# Altium schematic sheet DIGITAL_INP.SchDoc
size A4; SheetNumber: 10; SheetTotal: 14
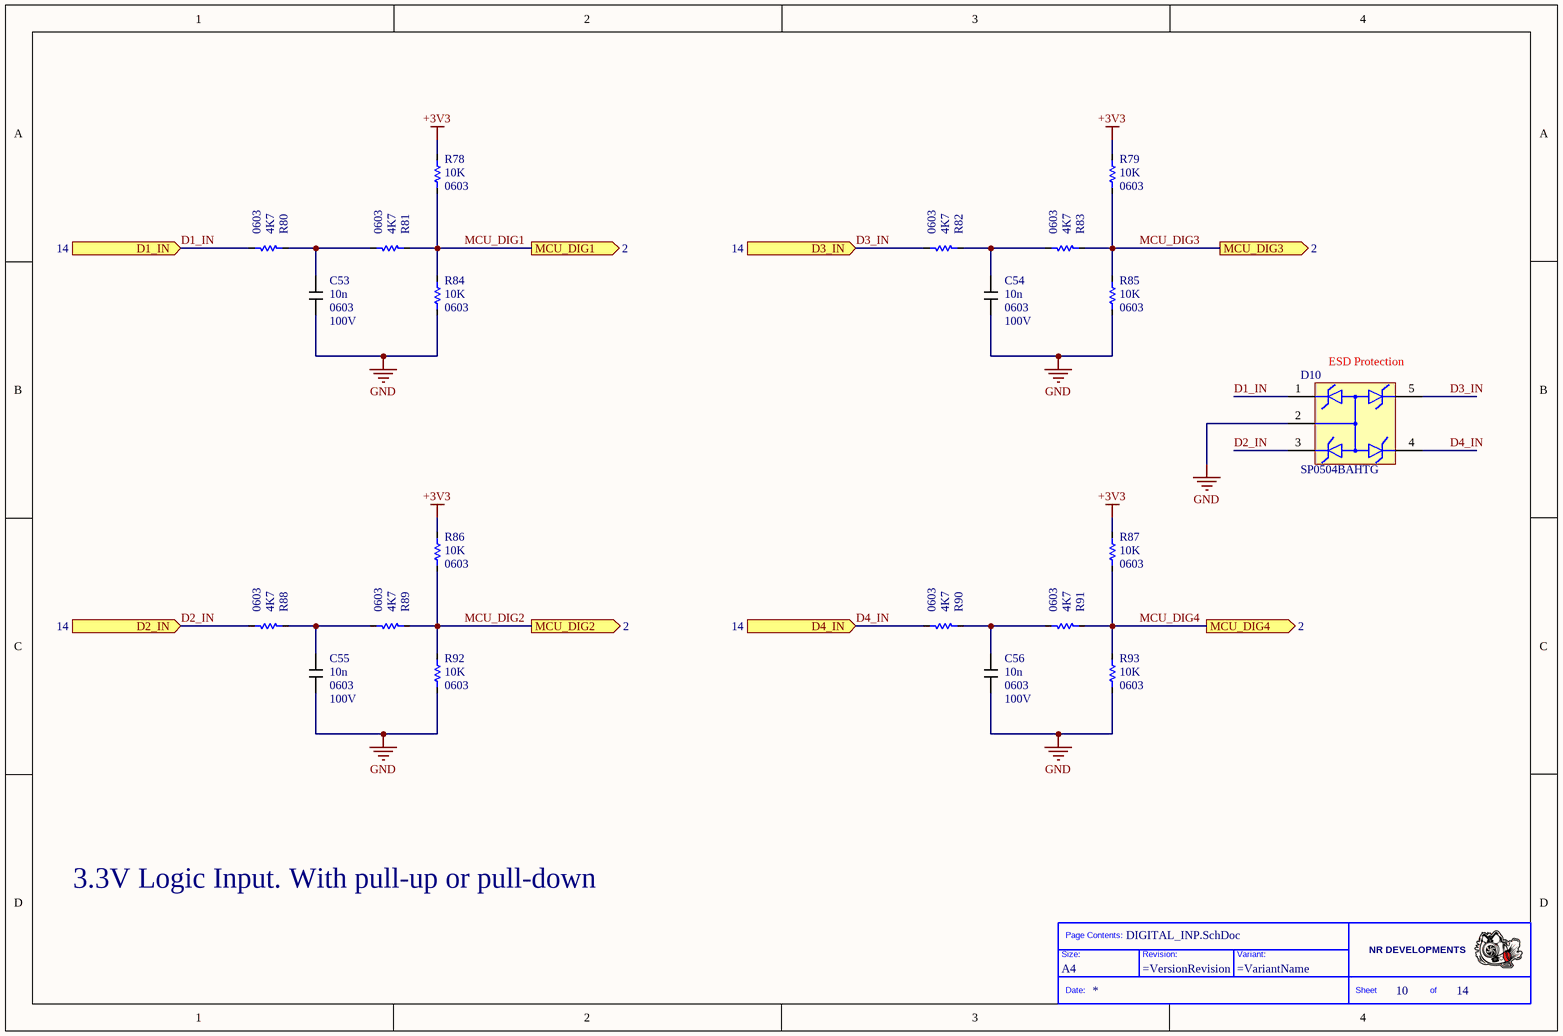
[diagram p0: DIGITAL_INP.SchDoc]

## Parts
*  Size: A4  (hidden comment: Title_Block)  (graphical)
C53  value 10n  Case: 0603  Voltage: 100V  [CAPC1608X09M]  (hidden comment: CAP)
C54  value 10n  Case: 0603  Voltage: 100V  [CAPC1608X09M]  (hidden comment: CAP)
C55  value 10n  Case: 0603  Voltage: 100V  [CAPC1608X09M]  (hidden comment: CAP)
C56  value 10n  Case: 0603  Voltage: 100V  [CAPC1608X09M]  (hidden comment: CAP)
D10  value SP0504BAHTG  [SOT95P280X145-5N]  (hidden comment: Diode TVS)
R78  value 10K  Case: 0603  [RESC1608X06M]  (hidden comment: Res)
R79  value 10K  Case: 0603  [RESC1608X06M]  (hidden comment: Res)
R80  value 4K7  Case: 0603  [RESC1608X06M]  (hidden comment: Res)
R81  value 4K7  Case: 0603  [RESC1608X06M]  (hidden comment: Res)
R82  value 4K7  Case: 0603  [RESC1608X06M]  (hidden comment: Res)
R83  value 4K7  Case: 0603  [RESC1608X06M]  (hidden comment: Res)
R84  value 10K  Case: 0603  [RESC1608X06M]  (hidden comment: Res)
R85  value 10K  Case: 0603  [RESC1608X06M]  (hidden comment: Res)
R86  value 10K  Case: 0603  [RESC1608X06M]  (hidden comment: Res)
R87  value 10K  Case: 0603  [RESC1608X06M]  (hidden comment: Res)
R88  value 4K7  Case: 0603  [RESC1608X06M]  (hidden comment: Res)
R89  value 4K7  Case: 0603  [RESC1608X06M]  (hidden comment: Res)
R90  value 4K7  Case: 0603  [RESC1608X06M]  (hidden comment: Res)
R91  value 4K7  Case: 0603  [RESC1608X06M]  (hidden comment: Res)
R92  value 10K  Case: 0603  [RESC1608X06M]  (hidden comment: Res)
R93  value 10K  Case: 0603  [RESC1608X06M]  (hidden comment: Res)

## Ports
D1_IN (in, see 14), D2_IN (in, see 14), D3_IN (in, see 14), D4_IN (in, see 14), MCU_DIG1 (out, see 2), MCU_DIG2 (out, see 2), MCU_DIG3 (out, see 2), MCU_DIG4 (out, see 2)

## Nets
+3V3: R78.2 R79.2 R86.2 R87.2
GND: C53.2 C54.2 C55.2 C56.2 D10.2 R84.1 R85.1 R92.1 R93.1
D1_IN: D10.1 R80.1 ; port D1_IN
D2_IN: D10.3 R88.1 ; port D2_IN
D3_IN: D10.5 R82.1 ; port D3_IN
D4_IN: D10.4 R90.1 ; port D4_IN
MCU_DIG1: R78.1 R81.2 R84.2 ; port MCU_DIG1
MCU_DIG2: R86.1 R89.2 R92.2 ; port MCU_DIG2
MCU_DIG3: R79.1 R83.2 R85.2 ; port MCU_DIG3
MCU_DIG4: R87.1 R91.2 R93.2 ; port MCU_DIG4
NetC53_1: C53.1 R80.2 R81.1
NetC54_1: C54.1 R82.2 R83.1
NetC55_1: C55.1 R88.2 R89.1
NetC56_1: C56.1 R90.2 R91.1

## Notes on the sheet
- (near D10) ESD Protection
- 3.3V Logic Input. With pull-up or pull-down
- (in symbol Title_Block) Page Contents:; NR DEVELOPMENTS; Size:; Revision:; Variant:; Date:; Sheet; of

## Library data of the parts
C53-C56 = CAP: Manufacturer: KEMET; PartNumber: C0603C103K1RACTU
D10 = SP0504BAHTG: Manufacturer: Littelfuse; Case: SOT-23-5; PartNumber: SP0504BAHTG
R78 R79 R84-R87 R92 R93 = Resistor: Manufacturer: YAGEO; PartNumber: AC0603FR-0710KL
R80-R83 R88-R91 = Resistor: Manufacturer: YAGEO; PartNumber: RC0603FR-074K7L